# EAGLE design esp v2 (EAGLE 7.1.0)
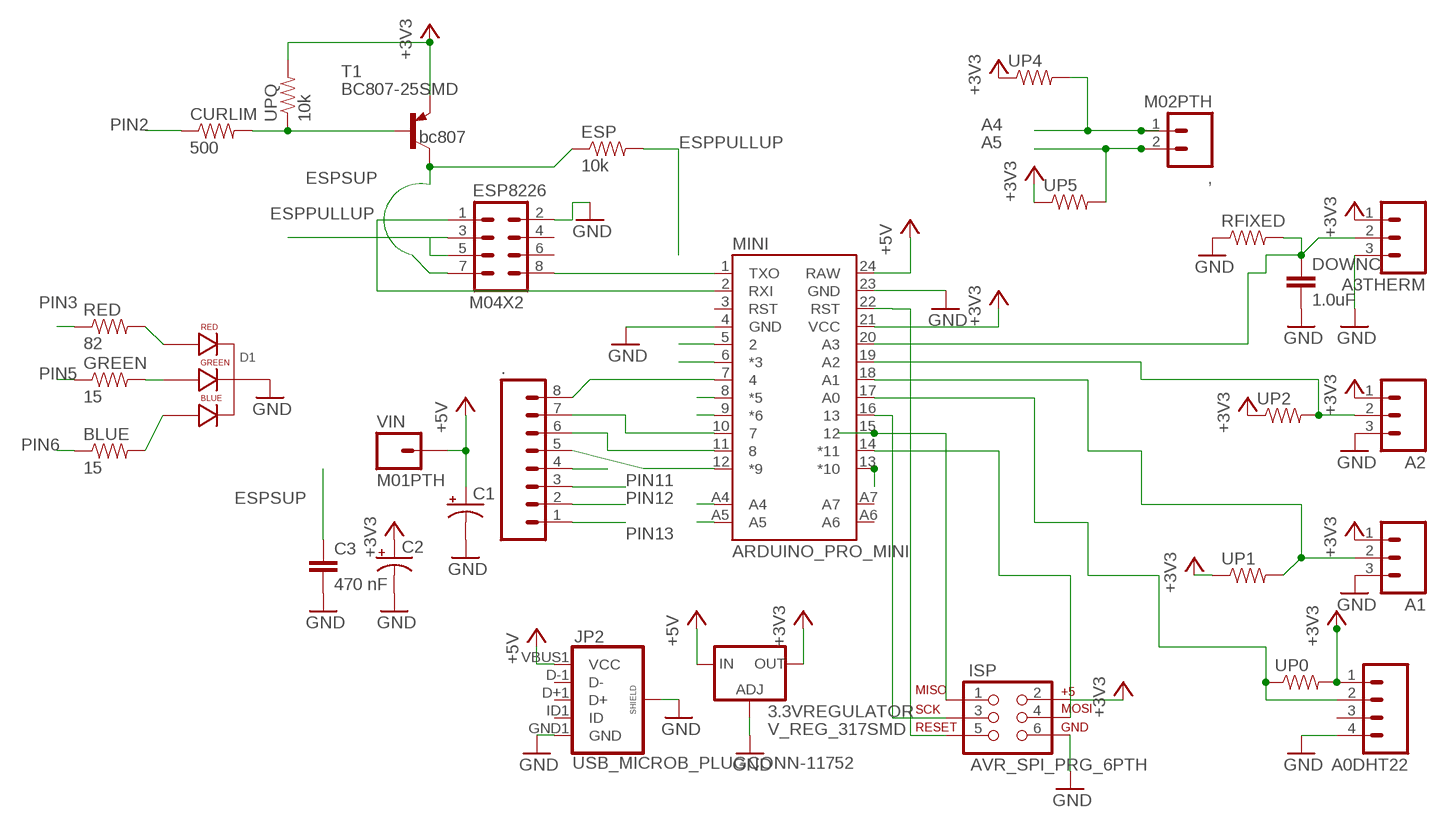
[diagram p0: schematic, sheet 1]

## Parts
3.3VREGULATOR  V_REG_317SMD  [SOT223]
,  M02PTH  [1X02]
.  M081X08  [1X08]
A0DHT22  M04PTH  [1X04]
A1  M03PTH  [1X03]
A2  M03PTH  [1X03]
A3THERM  M03PTH  [1X03]
BLUE  15  0.3OHM-1/8W-1%(0805)  [0805]
C1  10UF-25V-20%(PTH)  [CPOL-RADIAL-10UF-25V]
C2  10UF-25V-20%(PTH)  [CPOL-RADIAL-10UF-25V]
C3  470 nF  1.0UF-25V-+80/-20(0805)  [0805]
CURLIM  500  0.3OHM-1/8W-1%(0805)  [0805]
D1  LED-RGB-CC-THRUDIFFUSE  [LED-RGB-THRU]
DOWNC  1.0uF  1.0UF-25V-+80/-20(0805)  [0805]
ESP  10k  0.3OHM-1/8W-1%(0805)  [0805]
ESP8226  M04X2  [2X4]
GREEN  15  0.3OHM-1/8W-1%(0805)  [0805]
ISP  AVR_SPI_PRG_6PTH  [2X3]
JP2  USB_MICROB_PLUGCONN-11752  [USB-B-MICRO-SMD_V03]
MINI  ARDUINO_PRO_MINI  [ARDUINO_PRO_MINI]
RED  82  0.3OHM-1/8W-1%(0805)  [0805]
RFIXED  0.3OHM-1/8W-1%(0805)  [0805]
T1  BC807-25SMD  [SOT23-BEC]
UP0  0.3OHM-1/8W-1%(0805)  [0805]
UP1  0.3OHM-1/8W-1%(0805)  [0805]
UP2  0.3OHM-1/8W-1%(0805)  [0805]
UP4  0.3OHM-1/8W-1%(0805)  [0805]
UP5  0.3OHM-1/8W-1%(0805)  [0805]
UPQ  10k  0.3OHM-1/8W-1%(0805)  [0805]
VIN  M01PTH  [1X01]

## Nets
+3V3: 3.3VREGULATOR.2(OUT) A0DHT22.1 A1.1 A2.1 A3THERM.1 C2.1(+) ISP.2 MINI.21(VCC) T1.E UP0.2 UP1.1 UP2.1 UP4.1 UP5.1 UPQ.2
+5V: 3.3VREGULATOR.3(IN) C1.1(+) JP2.VBUS1(VCC) MINI.24(RAW) VIN.1
A4: ,.1 MINI.A4 UP4.2
A5: ,.2 MINI.A5 UP5.2
ESPPULLUP: ESP8226.3 ESP8226.5 ESP.2
ESPSUP: C3.1 ESP8226.7 ESP.1 T1.C
GND: 3.3VREGULATOR.1(ADJ) A0DHT22.4 A1.3 A2.3 A3THERM.3 C1.2(-) C2.2(-) C3.2 D1.2(CATHODE) DOWNC.2 ESP8226.2 ISP.6 JP2.GND1(GND) JP2.SHIELD1(SHIELD) JP2.SHIELD2(SHIELD) JP2.SHIELD3(SHIELD) MINI.4(GND) MINI.23(GND) RFIXED.1
N$1: ESP8226.1 MINI.2(RXI)
N$2: ESP8226.8 MINI.1(TXO)
N$3: A2.2 MINI.19(A2) UP2.2
N$4: A3THERM.2 DOWNC.1 MINI.20(A3) RFIXED.2
N$5: ..6 MINI.11
N$6: CURLIM.2 T1.B UPQ.1
N$7: D1.1(RED_CATHODE) RED.2
N$8: A0DHT22.2 MINI.17(A0) UP0.1
N$9: D1.3(GREEN_CATHODE) GREEN.2
N$10: BLUE.2 D1.4(BLUE_CATHODE)
N$11: ..8 MINI.7
N$12: ..7 MINI.10
N$13: ..5 MINI.12(*9)
N$19: A1.2 MINI.18(A1) UP1.2
PIN2: CURLIM.1 MINI.5
PIN3: MINI.6(*3) RED.1
PIN5: GREEN.1 MINI.8(*5)
PIN6: BLUE.1 MINI.9(*6)
PIN10: ..4 MINI.13(*10)
PIN11: ..3 ISP.4 MINI.14(*11)
PIN12: ..2 ISP.1 MINI.15
PIN13: ..1 ISP.3 MINI.16
RST: ISP.5 MINI.22(RST)
Unconnected: A0DHT22.3 ESP8226.4 ESP8226.6 JP2.D+1(D+) JP2.D-1(D-) JP2.ID1(ID) MINI.3(RST) MINI.A6 MINI.A7

## Notes on the sheet
- bc807

## Library data of the parts
3.3VREGULATOR = SparkFun-PowerIC:V_REG_317: Voltage Regulator Standard LM317 adjustable voltage regulator. AOI (Adjust Output Input). Google 'LM317 Calculator' for easy to use app to get the two resistor values needed. 240/720 for 5V output. 240/390 for 3.3V output. Spark Fun Electronics SKU : COM-00527
, = SparkFun-Connectors:M02: Standard 2-pin 0.1" header. Use with - straight break away headers ( PRT-00116) - right angle break away headers (PRT-00553) - swiss pins (PRT-00743) - machine pins (PRT-00117) - female headers (PRT-00115) Molex polarized connector foot print use with: PRT-08233 with associated crimp pins and housings. 2.54_SCREWTERM for use with PRT-10571. 3.5mm Screw Terminal footprints for PRT-08084 5mm Screw Terminal footprints for use with PRT-08432
. = SparkFun-Connectors:M08: Header 8 Standard 8-pin 0.1" header. Use with straight break away headers (SKU : PRT-00116), right angle break away headers (PRT-00553), swiss pins (PRT-00743), machine pins (PRT-00117), and female headers (PRT-00115).
A0DHT22 = SparkFun-Connectors:M04: Header 4 Standard 4-pin 0.1" header. Use with straight break away headers (SKU : PRT-00116), right angle break away headers (PRT-00553), swiss pins (PRT-00743), machine pins (PRT-00117), and female headers (PRT-00115). Molex polarized connector foot print use with SKU : PRT-08231 with associated crimp pins and housings. 1MM SMD Version SKU: PRT-10208
A1 A2 A3THERM = SparkFun-Connectors:M03: Header 3 Standard 3-pin 0.1" header. Use with straight break away headers (SKU : PRT-00116), right angle break away headers (PRT-00553), swiss pins (PRT-00743), machine pins (PRT-00117), and female headers (PRT-00115). Molex polarized connector foot print use with SKU : PRT-08232 with associated crimp pins and housings.
BLUE CURLIM ESP GREEN RED RFIXED UP0 UP1 UP2 UP4 UP5 UPQ = SparkFun-Resistors:0.3OHM-1/8W-1%(0805): RES-11622; PROD_ID: RES-11622; VALUE: 0.3
C1 C2 = SparkFun-Capacitors:10UF-25V-20%(PTH): CAP-08440; PROD_ID: CAP-08440
C3 = SparkFun-Capacitors:1.0UF-25V-+80/-20(0805): CAP-11625; PROD_ID: CAP-11625; VALUE: 1.0uF
D1 = SparkFun-LED:LED-RGB-CC-THRU: RGB Through-hole common cathode LED SparkFun Storefront: COM-00105 (Clear) COM-09264 (Diffuse); PROD_ID: DIO-09434
DOWNC = SparkFun-Capacitors:1.0UF-25V-+80/-20(0805): CAP-11625; PROD_ID: CAP-11625
ESP8226 = SparkFun-Connectors:M04X2: .1" header, two rows of four.
ISP = SparkFun-Connectors:AVR_SPI_PRG_6: AVR ISP 6 Pin This is the reduced ISP connector for AVR programming. Common on Arduino. This footprint will take up less PCB space and can be used with a 10-pin to 6-pin adapter such as SKU: BOB-08508 **Special note about "TEST_POINT" package. The stop mask is on the top side, so if you want your programming test points to be on the bottom of your board, make sure to place this package on the bottom side of the board. This also ensure that the orientation to program from the bottom side will be correct.
JP2 = SparkFun-Connectors:USB_MICROB_PLUG: USB Micro-B connectors Some male, some female. Watch your step!; PROD_ID: CONN-11752
MINI = SparkFun-Boards:ARDUINO_PRO_MINI
T1 = transistor-pnp:BC807*: PNP Transistror
VIN = SparkFun-Connectors:M01: Header 1 Standard 1-pin 0.1" header. Use with straight break away headers (SKU : PRT-00116), right angle break away headers (PRT-00553), swiss pins (PRT-00743), machine pins (PRT-00117), and female headers (PRT-00115).

## Board
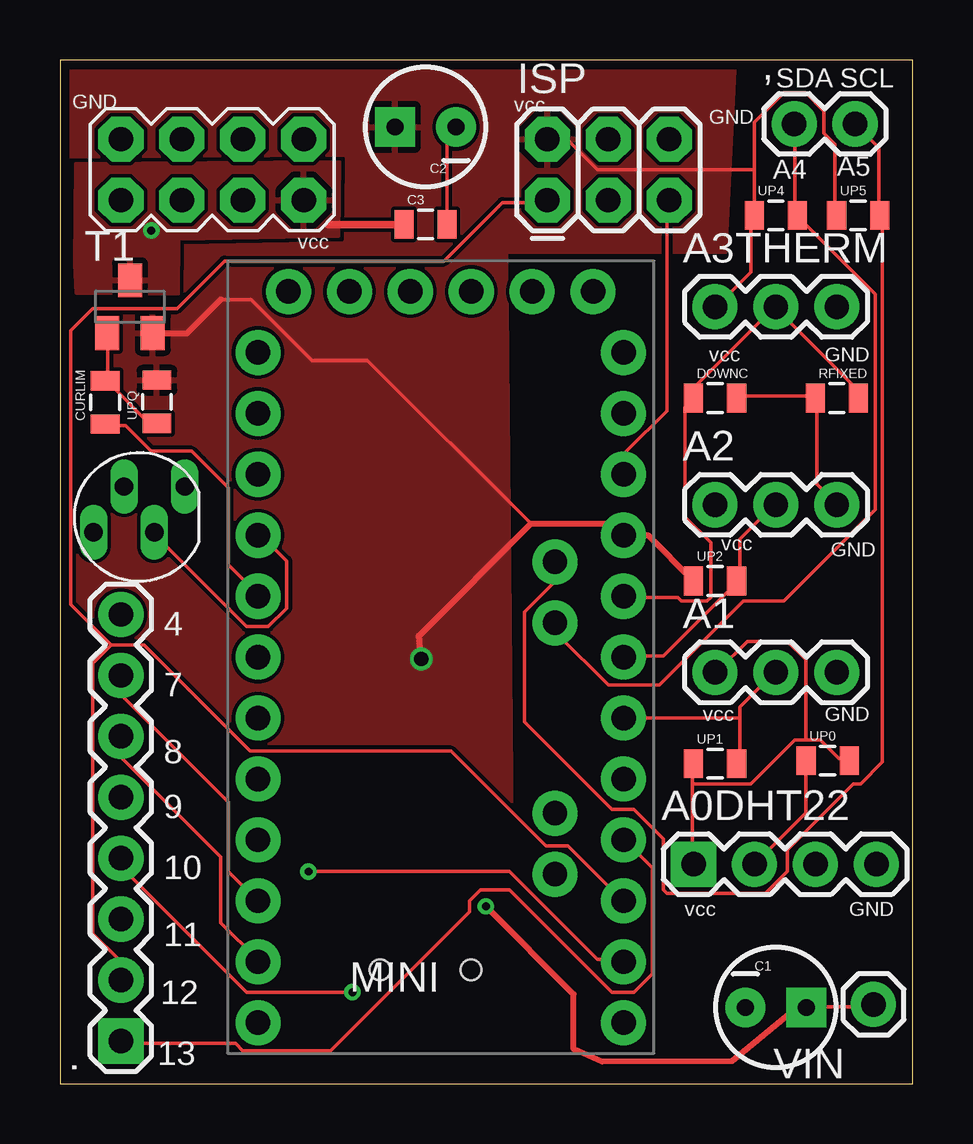
[diagram p1: board, top side]
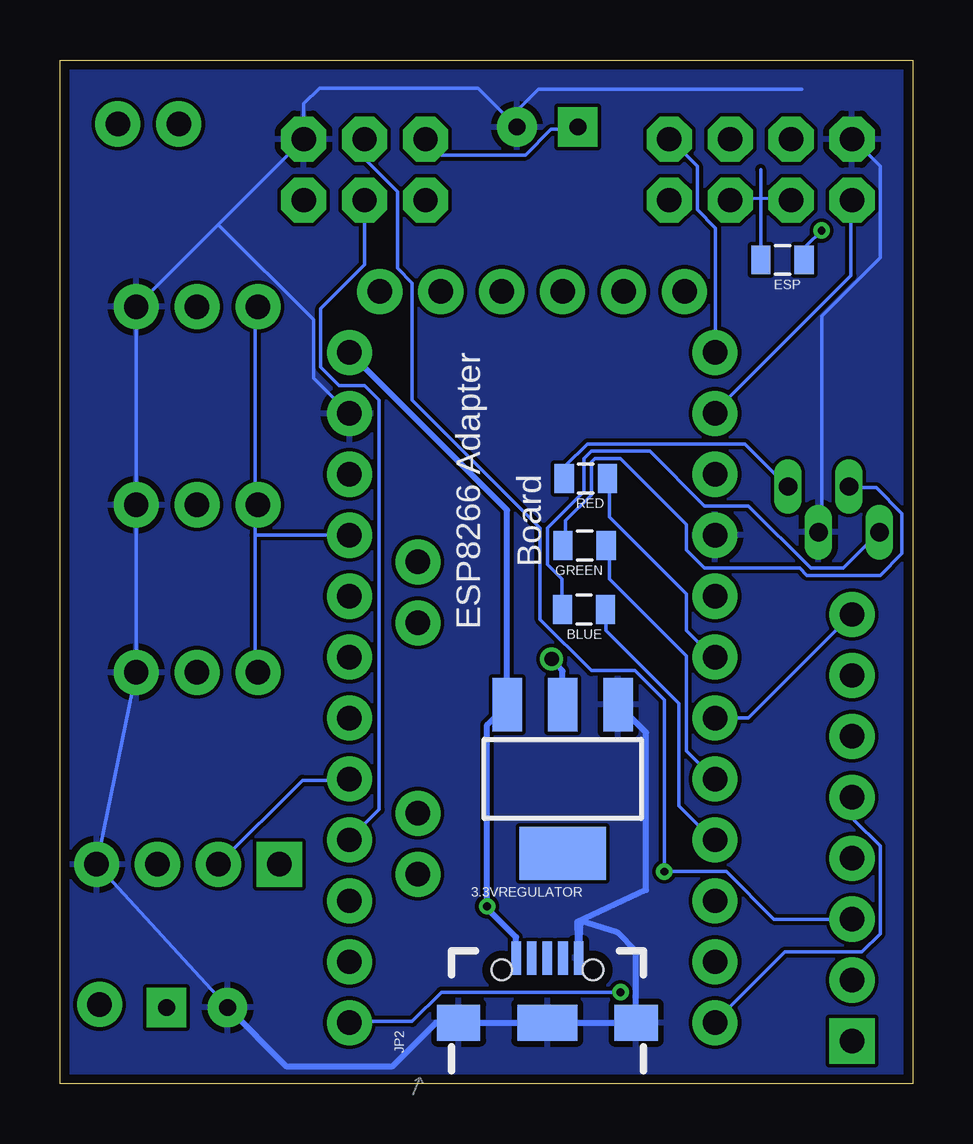
[diagram p2: board, bottom side, seen from below]

Size 35.56 x 42.67 mm. Coordinates in mm from the lower left corner, seen from the top.
Outline: 0,0 35.56,0 35.56,42.67 0,42.67 0,0
Copper layers (1*16): Top 0.0356mm / dielectric 1.5011mm / Bottom 0.0356mm
Design rules "LaenPCBOrder": minimum track width 6mil, minimum drill 13mil, track to track 6mil, track to pad 6mil, pad to pad 6mil, via to via 6mil, smd to smd 6mil, copper to edge 15mil, drill to drill 6mil, minimum pad ring 7mil, minimum via ring 7mil, stop-mask expansion 3mil, vias tented up to drill 0mil, thermal gap 10mil

### Footprints (pad centres in the part's own frame; a part is rotated, then mirrored left to right if it is on the bottom)
SOT223 = smd 1.219 x 2.235: 1 -2.311,-3.099; 2 0,-3.099; 3 2.311,-3.099 | smd 3.6 x 2.2: 4 0,3.099
1X02 = drill 1.016 pad 1.88: 1 0,0; 2 2.54,0
1X08 = drill 1.016 pad 1.88 square: 1 0,0 | drill 1.016 pad 1.88: 2 2.54,0; 3 5.08,0; 4 7.62,0; 5 10.16,0; 6 12.7,0; 7 15.24,0; 8 17.78,0
1X04 = drill 1.016 pad 1.88 square: 1 0,0 | drill 1.016 pad 1.88: 2 2.54,0; 3 5.08,0; 4 7.62,0
1X03 = drill 1.016 pad 1.88: 1 0,0; 2 2.54,0; 3 5.08,0
0805 = smd 0.8 x 1.2: 1 -0.9,0; 2 0.9,0
CPOL-RADIAL-10UF-25V = drill 0.7 pad 1.651 square: 1 1.27,0 | drill 0.7 pad 1.651: 2 -1.27,0
LED-RGB-THRU = drill 0.762 pad 0.889 long: 1 1.905,1.27; 2 0.635,-0.635; 3 -0.635,1.27; 4 -1.905,-0.635
2X4 = drill 1.016 pad 1.88 octagon: 1 -3.81,-1.27; 2 -3.81,1.27; 3 -1.27,-1.27; 4 -1.27,1.27; 5 1.27,-1.27; 6 1.27,1.27; 7 3.81,-1.27; 8 3.81,1.27
2X3 = drill 1.016 pad 1.88 octagon: 1 0,0; 2 0,2.54; 3 2.54,0; 4 2.54,2.54; 5 5.08,0; 6 5.08,2.54
USB-B-MICRO-SMD_V03 = smd 1.4 x 0.4: D+1 2.7,0; D-1 2.7,0.65; GND1 2.7,-1.3; ID1 2.7,-0.65; VBUS1 2.7,1.3 | smd 1.5 x 1.8: SHIELD1 0,3.7; SHIELD2 0,-3.7 | smd 1.5 x 2.5: SHIELD3 0,0 | hole 0.85: 2.2,1.9; 2.2,-1.9
ARDUINO_PRO_MINI = drill 1.016 pad 1.88: 1 -7.62,12.7; 2 -7.62,10.16; 3 -7.62,7.62; 4 -7.62,5.08; 5 -7.62,2.54; 6 -7.62,0; 7 -7.62,-2.54; 8 -7.62,-5.08; 9 -7.62,-7.62; 10 -7.62,-10.16; 11 -7.62,-12.7; 12 -7.62,-15.24; 13 7.62,-15.24; 14 7.62,-12.7; 15 7.62,-10.16; 16 7.62,-7.62; 17 7.62,-5.08; 18 7.62,-2.54; 19 7.62,0; 20 7.62,2.54; 21 7.62,5.08; 22 7.62,7.62; 23 7.62,10.16; 24 7.62,12.7; A4 4.763,1.429; A5 4.763,3.969; A6 4.763,-9.049; A7 4.763,-6.509; BLK -6.35,15.24; GND -3.81,15.24; GRN 6.35,15.24; RXI 1.27,15.24; TXO 3.81,15.24; VCC -1.27,15.24
SOT23-BEC = smd 1 x 1.4: B -0.95,-1.1; C 0,1.1; E 0.95,-1.1
1X01 = drill 1.016 pad 1.88: 1 0,0

### Placement (x,y rotation side)
3.3VREGULATOR  14.61,12.7 180 bottom
,  30.61,40.01 0 top
.  2.54,1.78 90 top
A0DHT22  26.42,9.14 0 top
A1  27.3,17.14 0 top
A2  27.3,24.13 0 top
A3THERM  27.3,32.38 0 top
BLUE  13.72,19.76 180 bottom
C1  29.84,3.17 0 top
C2  15.24,39.88 180 top
C3  15.24,35.81 0 top
CURLIM  1.88,28.4 90 top
D1  3.3,23.62 0 top
DOWNC  27.3,28.57 0 top
ESP  5.44,34.34 180 bottom
ESP8226  6.35,38.1 0 top
GREEN  13.69,22.43 180 bottom
ISP  20.32,36.83 0 top
JP2  15.24,2.54 90 bottom
MINI  15.88,17.78 0 top
RED  13.64,25.22 180 bottom
RFIXED  32.38,28.57 0 top
T1  2.92,32.38 0 top
UP0  32,13.46 0 top
UP1  27.3,13.34 0 top
UP2  27.3,20.95 0 top
UP4  29.84,36.2 0 top
UP5  33.27,36.2 0 top
UPQ  4.04,28.42 90 top
VIN  33.91,3.3 180 top

### Tracks (layer width: path | path; a pad name or v marks a point on that pad's centre or on a via)
+3V3  (via drill 0.6)
  Top 0.152: 6.71,32.69 7.98,32.69 10.52,30.15 12.83,30.15 19.63,23.34 | 26.36,12.5 26.36,9.14 A0DHT22.1 | 26.36,12.5 26.36,13.26 UP1.1 | 31.09,14.33 30.63,14.33 28.8,12.5 26.36,12.5 | 31.09,14.33 31.7,14.33 32.46,13.56 32.77,13.56 UP0.2 | 31.09,14.33 31.09,17.68 30.33,18.44 28.65,18.44 27.43,17.22 A1.1 | A3THERM.1 27.43,32.46 28.8,33.83 28.8,36.12 UP4.1 28.96,36.27 28.96,38.1 | 28.96,38.1 28.96,40.08 30.18,41.3 31.09,41.3 31.85,40.54 31.85,39.62 32.31,39.17 32.31,36.27 UP5.1 | 28.96,38.1 22.4,38.1 21.18,39.32 20.42,39.32 ISP.2
  Top 0.254: v15.06,17.7 14.96,18.67 19.63,23.34 23.01,23.34 MINI.21 24.5,22.86 UP2.1 | T1.E 5.3,31.29 6.71,32.69
  Bottom 0.152: 27.43,22.86 27.43,24.08 A2.1 27.43,24.23 27.43,32.31 A3THERM.1 | 27.43,22.86 27.43,17.22 A1.1 | MINI.21 27.43,22.86 | ISP.2 19.66,38.71 16.15,38.71 15.09,39.78 14.02,39.78 C2.1
  Bottom 0.254: 3.3VREGULATOR.2 14.61,17.2 v15.06,17.7
  pour Top (rank 2): -5.64,-1.09 -5.64,44.2 28.27,44.78 27.76,34.67 18.62,34.67 18.97,-2.54
+5V  (via drill 0.33)
  Top 0.152: VIN.1 33.83,3.2 31.24,3.2 C1.1
  Top 0.254: C1.1 30.73,3.17 28.02,0.94 22.61,0.91 21.41,1.45 21.41,3.73 v17.75,7.39
  Bottom 0.254: JP2.VBUS1 16.54,6.1 17.75,7.32 v17.75,7.39 17.75,14.96 3.3VREGULATOR.3 16.92,23.9 MINI.24
A4
  Top 0.152: ,.1 30.63,39.93 30.63,36.27 UP4.2 30.79,36.12 33.98,32.92 33.98,23.93 30.18,20.12 28.5,20.12 24.99,16.61 22.86,16.61 20.73,18.75 20.73,19.2 MINI.A4
A5
  Top 0.152: ,.2 34.14,39.01 34.14,36.27 UP5.2 34.29,36.12 34.29,13.41 33.38,12.5 33.07,12.5 30.33,9.75 30.33,8.84 29.41,7.92 25.3,7.92 25.15,8.08 25.15,10.21 23.93,11.43 23.01,11.43 19.36,15.09 19.36,19.66 20.57,20.88 20.57,21.64 MINI.A5
ESPPULLUP
  Bottom 0.152: 6.35,38.1 6.35,36.91 | 6.35,36.91 6.35,34.92 ESP.2 | ESP8226.3 6.35,36.91 | ESP8226.5 6.35,36.91
ESPSUP  (via drill 0.33)
  Top 0.305: C3.1 11.18,35.81
  Bottom 0.152: v3.81,35.56 4.45,34.92 ESP.1
  pour Top: 0.61,34.19 0.69,32.94 4.93,32.92 4.95,35.2 11.61,35.33 11.66,38.43 0.66,38.35
GND
  Top 0.152: C3.2 16.14,39.51 C2.2 | D1.2 3.96,22.86 7.77,19.05 8.69,19.05 9.45,19.81 9.45,21.79 8.38,22.86 MINI.4 | DOWNC.2 28.35,28.65 31.39,28.65 RFIXED.1 31.55,28.5 31.55,24.99 32.31,24.23 A2.3
  Bottom 0.152: 4.62,41.45 15.62,41.45 16.51,40.56 C2.2 18.14,41.5 24.74,41.5 25.4,40.84 ISP.6 28.96,35.81 | 28.96,35.81 A3THERM.3 A2.3 A1.3 | A1.3 32.38,16.59 32.28,16.48 32.28,17.04 A1.3 | A1.3 A0DHT22.4 C1.2 | 28.96,35.81 24.99,31.85 24.99,29.41 23.62,28.04 MINI.23 | 2.44,39.32 1.37,38.25 1.37,34.44 3.81,32 3.81,23.01 D1.2
  Bottom 0.254: C1.2 26.11,0.71 21.72,0.71 19.89,2.54 JP2.SHIELD1 JP2.SHIELD3 JP2.SHIELD2 11.54,5.52 12.32,6.3 13.87,6.78 JP2.GND1 13.99,6.74 11.12,8.08 11.12,14.63 3.3VREGULATOR.1
  pour Bottom: -2.82,-2.29 -2.41,43.43 37.74,43.43 37.74,-2.11
N$1
  Bottom 0.152: ESP8226.1 2.59,36.73 2.59,33.68 8.23,28.04 MINI.2
N$2
  Bottom 0.152: MINI.1 8.23,30.48 8.23,35.66 8.99,36.42 8.99,38.25 10.06,39.32 ESP8226.8
N$3
  Top 0.152: A2.2 29.72,24.08 28.35,22.71 28.35,21.03 UP2.2 28.19,20.88 25.15,17.83 23.62,17.83 MINI.19
N$4
  Top 0.152: RFIXED.2 33.22,28.65 33.22,28.96 29.87,32.31 A3THERM.2 29.72,32.31 26.52,29.11 26.52,28.65 DOWNC.1 26.36,28.5 26.06,28.19 26.06,23.62 27.13,22.55 27.13,20.27 26.98,20.12 25.91,20.12 25.76,20.27 23.62,20.27 MINI.20
N$5
  Top 0.152: ..6 2.59,14.48 2.59,13.56 6.71,9.45 6.71,6.71 8.23,5.18 MINI.11
N$6
  Top 0.152: T1.B 1.98,31.24 1.98,29.41 CURLIM.2 1.98,29.26 3.66,27.58 3.96,27.58 UPQ.1
N$7
  Bottom 0.152: RED.2 14.48,25.3 14.48,25.76 13.56,26.67 7.01,26.67 5.33,24.99 D1.1
N$8
  Top 0.152: A0DHT22.2 31.09,11.28 31.09,13.41 UP0.1
  Bottom 0.152: A0DHT22.2 25.45,12.65 23.62,12.65 MINI.17
N$9
  Bottom 0.152: GREEN.2 14.48,22.55 14.48,23.47 13.41,24.54 13.41,25.91 13.26,26.06 12.19,26.06 9.45,23.32 9.45,22.25 8.69,21.49 4.72,21.49 4.42,21.18 1.37,21.18 0.46,22.1 0.46,23.77 1.52,24.84 2.59,24.84 D1.3
N$10
  Bottom 0.152: D1.4 2.9,21.49 4.27,21.49 6.86,24.08 8.69,24.08 10.97,26.36 13.41,26.36 13.72,26.06 13.72,24.69 15.24,23.16 15.24,21.64 14.63,21.03 14.63,19.81 BLUE.2
N$11
  Bottom 0.152: MINI.7 6.86,15.24 ..8
N$12
  Top 0.152: ..7 2.59,16.92 2.59,16.15 7.01,11.73 7.01,8.84 8.23,7.62 MINI.10
N$13
  Bottom 0.152: ..5 2.44,11.89 2.44,10.97 1.37,9.91 1.37,6.25 2.13,5.49 5.33,5.49 8.23,2.59 MINI.12
N$19
  Top 0.152: 28.35,15.24 28.35,15.7 29.72,17.07 A1.2 | 28.35,15.24 28.35,13.41 UP1.2 | 28.35,15.24 MINI.18
PIN2
  Top 0.152: CURLIM.1 1.98,27.43 2.74,27.43 3.81,26.36 5.49,26.36 7.01,24.84 7.01,21.64 8.23,20.42 MINI.5
PIN3
  Bottom 0.152: RED.1 12.65,25.15 12.65,23.62 9.45,20.42 9.45,18.9 8.38,17.83 MINI.6
PIN5
  Bottom 0.152: GREEN.1 12.65,22.4 12.65,21.03 9.45,17.83 9.45,13.87 8.38,12.8 MINI.8
PIN6
  Bottom 0.152: BLUE.1 12.8,19.66 12.8,18.9 9.75,15.85 9.75,11.58 8.38,10.21 MINI.9
PIN10  (via drill 0.33)
  Top 0.152: v12.19,3.81 7.77,3.81 2.59,8.99 2.59,9.3 ..4
  Bottom 0.152: v12.19,3.81 19.66,3.81 20.88,2.59 23.47,2.59 MINI.13
PIN11  (via drill 0.33)
  Top 0.152: v10.36,8.84 18.75,8.84 22.4,5.18 23.47,5.18 MINI.14
  Bottom 0.152: ..3 5.79,6.86 7.77,8.84 v10.36,8.84 10.36,16 11.58,17.22 13.41,17.22 15.54,19.36 15.54,23.16 20.88,28.5 20.88,33.38 21.49,33.98 21.49,37.19 22.86,38.56 ISP.4
PIN12
  Top 0.152: 2.13,18.29 1.37,17.53 1.37,6.25 2.44,5.18 2.44,4.42 ..2 | 2.13,18.29 3.5,18.29 7.92,13.87 16.31,13.87 20.27,9.91 21.18,9.91 23.47,7.62 MINI.15 | 2.13,18.29 0.46,19.96 0.46,31.39 1.37,32.31 4.88,32.31 6.86,34.29 16,34.29 18.44,36.73 20.27,36.73 ISP.1
PIN13
  Top 0.152: ..1 2.59,1.68 7.32,1.68 7.62,1.37 11.28,1.37 17.07,7.16 17.07,7.62 17.53,8.08 18.75,8.08 23.01,3.81 23.93,3.81 24.69,4.57 24.69,8.99 23.62,10.06 MINI.16
  Bottom 0.152: ISP.3 22.86,34.14 24.69,32.31 24.69,29.87 23.93,29.11 22.86,29.11 22.25,28.5 22.25,11.43 23.47,10.21 MINI.16
RST
  Top 0.152: MINI.22 23.62,25.45 23.62,26.36 25.3,28.04 25.3,36.73 ISP.5

### Text on the board
tNames: SDA | SCL | GND | vcc | GND | A4 | A5 | vcc | vcc | GND | vcc | GND | 4 | 7 | vcc | GND | 8 | 9 | 10 | vcc | GND | 11 | 12 | 13
bNames: ESP8266 Adapter | Board